# EAGLE schematic single_board_controller_copy (EAGLE 9.3.0)
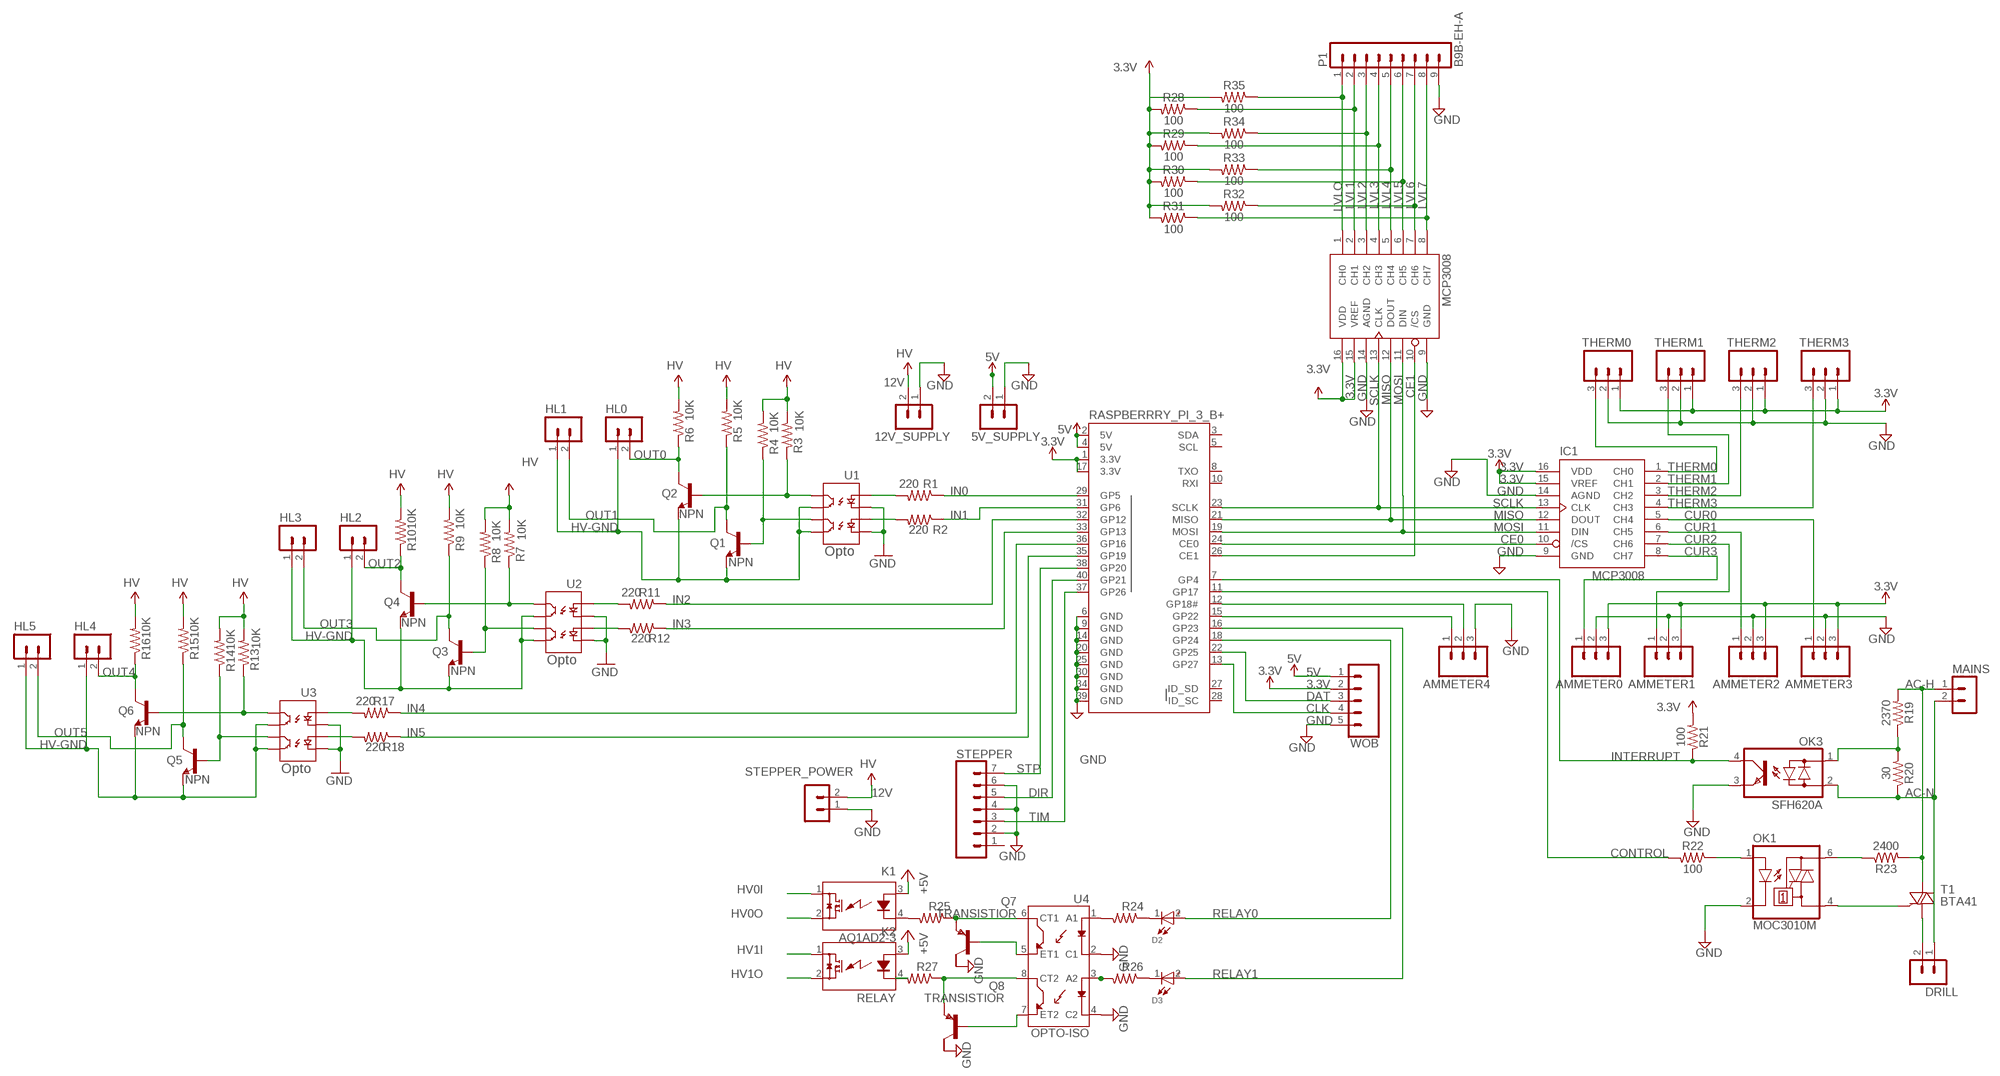
[diagram p0: schematic, sheet 1]

## Parts
5V_SUPPLY  B2P-VH  [B2P-VH]
12V_SUPPLY  B2P-VH  [B2P-VH]
AMMETER0  CONN_03JST-PTH-VERT  [JST-3-PTH-VERT]
AMMETER1  CONN_03JST-PTH-VERT  [JST-3-PTH-VERT]
AMMETER2  CONN_03JST-PTH-VERT  [JST-3-PTH-VERT]
AMMETER3  CONN_03JST-PTH-VERT  [JST-3-PTH-VERT]
AMMETER4  CONN_03JST-PTH-VERT  [JST-3-PTH-VERT]
D2  WL-SMRW_1206_156120YS75000-Y  [WL-SMRW-1206-RECT]
D3  WL-SMRW_1206_156120YS75000-Y  [WL-SMRW-1206-RECT]
DRILL  B2P-VH  [B2P-VH]
HL0  B2P-VH  [B2P-VH]
HL1  B2P-VH  [B2P-VH]
HL2  B2P-VH  [B2P-VH]
HL3  B2P-VH  [B2P-VH]
HL4  B2P-VH  [B2P-VH]
HL5  B2P-VH  [B2P-VH]
IC1  MCP3008  [DIL16]
IC2  MCP3008  [DIL16]
K1  AQ1AD2-3  [AQ1]
K2  RELAY  AQ1AD2-3  [AQ1]
MAINS  B2P-VH  [B2P-VH]
OK1  MOC3010M  [DIL06]
OK3  SFH620A  [DIL04]
P1  B9B-EH-A  [B9B-EH-A]
Q1  NPN  TRANSISTOR_NPNMMBT2222A  [SOT23-3]
Q2  NPN  TRANSISTOR_NPNMMBT2222A  [SOT23-3]
Q3  NPN  TRANSISTOR_NPNMMBT2222A  [SOT23-3]
Q4  NPN  TRANSISTOR_NPNMMBT2222A  [SOT23-3]
Q5  NPN  TRANSISTOR_NPNMMBT2222A  [SOT23-3]
Q6  NPN  TRANSISTOR_NPNMMBT2222A  [SOT23-3]
Q7  TRANSISTIOR  PNP-TRANSISTIOR-2COLSOT89  [SOT89]
Q8  TRANSISTIOR  PNP-TRANSISTIOR-2COLSOT89  [SOT89]
R1  220  220OHM-1/10W-1%(0603)  [0603-RES]
R2  220  220OHM-1/10W-1%(0603)  [0603-RES]
R3  10K  10KOHM1/10W1%(0603)0603  [0603-RES]
R4  10K  10KOHM1/10W1%(0603)0603  [0603-RES]
R5  10K  10KOHM1/10W1%(0603)0603  [0603-RES]
R6  10K  10KOHM1/10W1%(0603)0603  [0603-RES]
R7  10K  10KOHM1/10W1%(0603)0603  [0603-RES]
R8  10K  10KOHM1/10W1%(0603)0603  [0603-RES]
R9  10K  10KOHM1/10W1%(0603)0603  [0603-RES]
R10  10K  10KOHM1/10W1%(0603)0603  [0603-RES]
R11  220  220OHM-1/10W-1%(0603)  [0603-RES]
R12  220  220OHM-1/10W-1%(0603)  [0603-RES]
R13  10K  10KOHM1/10W1%(0603)0603  [0603-RES]
R14  10K  10KOHM1/10W1%(0603)0603  [0603-RES]
R15  10K  10KOHM1/10W1%(0603)0603  [0603-RES]
R16  10K  10KOHM1/10W1%(0603)0603  [0603-RES]
R17  220  220OHM-1/10W-1%(0603)  [0603-RES]
R18  220  220OHM-1/10W-1%(0603)  [0603-RES]
R19  2370  0.3OHM-0805-1/8W-1%  [0805]
R20  30  0.3OHM-0805-1/8W-1%  [0805]
R21  100  0.3OHM-0805-1/8W-1%  [0805]
R22  100  0.3OHM-0805-1/8W-1%  [0805]
R23  2400  0.3OHM-0805-1/8W-1%  [0805]
R24  FLIPFLOP-RES  [0805-THM]
R25  FLIPFLOP-RES  [0805-THM]
R26  FLIPFLOP-RES  [0805-THM]
R27  FLIPFLOP-RES  [0805-THM]
R28  100  0.3OHM-0805-1/8W-1%  [0805]
R29  100  0.3OHM-0805-1/8W-1%  [0805]
R30  100  0.3OHM-0805-1/8W-1%  [0805]
R31  100  0.3OHM-0805-1/8W-1%  [0805]
R32  100  0.3OHM-0805-1/8W-1%  [0805]
R33  100  0.3OHM-0805-1/8W-1%  [0805]
R34  100  0.3OHM-0805-1/8W-1%  [0805]
R35  100  0.3OHM-0805-1/8W-1%  [0805]
RASPBERRRY_PI_3_B+  RASPBERRYPI-40-PIN-GPIO_PTH_NO_SHROUD  [2X20]
STEPPER  CONN_07  [1X07]
STEPPER_POWER  B2P-VH  [B2P-VH]
T1  BTA41  BTA26-H  [TOP3L-1]
THERM0  CONN_03JST-PTH-VERT  [JST-3-PTH-VERT]
THERM1  CONN_03JST-PTH-VERT  [JST-3-PTH-VERT]
THERM2  CONN_03JST-PTH-VERT  [JST-3-PTH-VERT]
THERM3  CONN_03JST-PTH-VERT  [JST-3-PTH-VERT]
U1  OPTOISOLATOR-2SOIC8  [SO08-2]
U2  OPTOISOLATOR-2SOIC8  [SO08-2]
U3  OPTOISOLATOR-2SOIC8  [SO08-2]
U4  OPTO-ISO  ILD213T-IDL213T  [SO08]
WOB  CONN_05JST-VERT  [JST-5-PTH-VERT]

## Nets
3.3V: AMMETER0.3 AMMETER1.3 AMMETER2.3 AMMETER3.3 IC1.15(VREF) IC1.16(VDD) IC2.15(VREF) IC2.16(VDD) R21.2 R28.2 R29.2 R30.2 R31.2 R32.2 R33.2 R34.2 R35.2 RASPBERRRY_PI_3_B+.1(3.3V) RASPBERRRY_PI_3_B+.17(3.3V) THERM0.1 THERM1.1 THERM2.1 THERM3.1 WOB.2
5V: 5V_SUPPLY.2 RASPBERRRY_PI_3_B+.2(5V) RASPBERRRY_PI_3_B+.4(5V) WOB.1
12V: 12V_SUPPLY.2 R3.2 R4.2 R5.2 R6.2 R7.2 R8.2 R9.2 R10.2 R13.2 R14.2 R15.2 R16.2 STEPPER_POWER.2 ; supply symbol labelled HV
+5V: K1.3(A) K2.3(A)
AC-H: MAINS.1 R19.2 R23.2 T1.A2
AC-N: DRILL.1 MAINS.2 OK3.2(AC2) R20.1
CE0: IC1.10(/CS) RASPBERRRY_PI_3_B+.24(CE0)
CE1: IC2.10(/CS) RASPBERRRY_PI_3_B+.26(CE1)
CLK: RASPBERRRY_PI_3_B+.13(GP27) WOB.4
CONTROL: R22.2 RASPBERRRY_PI_3_B+.11(GP17)
CUR0: AMMETER3.1 IC1.5(CH4)
CUR1: AMMETER2.1 IC1.6(CH5)
CUR2: AMMETER1.1 IC1.7(CH6)
CUR3: AMMETER0.1 IC1.8(CH7)
DAT: RASPBERRRY_PI_3_B+.22(GP25) WOB.3
DIR: RASPBERRRY_PI_3_B+.40(GP21) STEPPER.5
GND: 5V_SUPPLY.1 12V_SUPPLY.1 AMMETER0.2 AMMETER1.2 AMMETER2.2 AMMETER3.2 AMMETER4.3 IC1.9(GND) IC1.14(AGND) IC2.9(GND) IC2.14(AGND) OK1.2(C) OK3.3(E) P1.9 Q7.2(C) Q8.2(C) RASPBERRRY_PI_3_B+.6(GND) RASPBERRRY_PI_3_B+.9(GND) RASPBERRRY_PI_3_B+.14(GND) RASPBERRRY_PI_3_B+.20(GND) RASPBERRRY_PI_3_B+.25(GND) RASPBERRRY_PI_3_B+.30(GND) RASPBERRRY_PI_3_B+.34(GND) RASPBERRRY_PI_3_B+.39(GND) STEPPER.2 STEPPER.4 STEPPER.6 STEPPER_POWER.1 THERM0.2 THERM1.2 THERM2.2 THERM3.2 U1.2(C1) U1.4(C2) U2.2(C1) U2.4(C2) U3.2(C1) U3.4(C2) U4.2(C1) U4.4(C2) WOB.5
HV0I: K1.1(DS1)
HV0O: K1.2(DS2)
HV1I: K2.1(DS1)
HV1O: K2.2(DS2)
HV-GND: HL0.1 HL1.1 HL2.1 HL3.1 HL4.1 HL5.1 Q1.2(E) Q2.2(E) Q3.2(E) Q4.2(E) Q5.2(E) Q6.2(E) U1.5(EM2) U1.7(EM1) U2.5(EM2) U2.7(EM1) U3.5(EM2) U3.7(EM1)
IN0: R1.1 RASPBERRRY_PI_3_B+.29(GP5)
IN1: R2.1 RASPBERRRY_PI_3_B+.31(GP6)
IN2: R11.1 RASPBERRRY_PI_3_B+.32(GP12)
IN3: R12.1 RASPBERRRY_PI_3_B+.33(GP13)
IN4: R17.1 RASPBERRRY_PI_3_B+.36(GP16)
IN5: R18.1 RASPBERRRY_PI_3_B+.35(GP19)
INTERRUPT: OK3.4(C) R21.1 RASPBERRRY_PI_3_B+.7(GP4)
LVL1: IC2.2(CH1) P1.2 R28.1
LVL2: IC2.3(CH2) P1.3 R34.1
LVL3: IC2.4(CH3) P1.4 R29.1
LVL4: IC2.5(CH4) P1.5 R33.1
LVL5: IC2.6(CH5) P1.6 R30.1
LVL6: IC2.7(CH6) P1.7 R32.1
LVL7: IC2.8(CH7) P1.8 R31.1
LVLO: IC2.1(CH0) P1.1 R35.1
MISO: IC1.12(DOUT) IC2.12(DOUT) RASPBERRRY_PI_3_B+.21(MISO)
MOSI: IC1.11(DIN) IC2.11(DIN) RASPBERRRY_PI_3_B+.19(MOSI)
N$1: R1.2 U1.1(A1)
N$2: R2.2 U1.3(A2)
N$3: R11.2 U2.1(A1)
N$4: R12.2 U2.3(A2)
N$5: R17.2 U3.1(A1)
N$6: R18.2 U3.3(A2)
N$7: OK3.1(AC1) R19.1 R20.2
N$8: OK1.1(A) R22.1
N$9: OK1.6(A2) R23.1
N$10: OK1.4(A1) T1.G
N$11: DRILL.2 T1.A1
N$12: R24.2 U4.1(A1)
N$13: D2.1(-) R24.1
N$14: R26.2 U4.3(A2)
N$15: D3.1(-) R26.1
N$16: Q7.3(E) R25.1 U4.6(CT1)
N$17: K1.4(K) R25.2
N$18: Q8.3(E) R27.1 U4.8(CT2)
N$19: K2.4(K) R27.2
N$20: Q7.1(B) U4.5(ET1)
N$21: Q8.1(B) U4.7(ET2)
N$22: AMMETER4.1 RASPBERRRY_PI_3_B+.15(GP22)
N$23: AMMETER4.2 RASPBERRRY_PI_3_B+.12(GP18#)
OUT0: HL0.2 Q2.3(C) R6.1
OUT1: HL1.2 Q1.3(C) R5.1
OUT1N: Q2.1(B) R3.1 U1.8(CL1)
OUT1N1: Q4.1(B) R7.1 U2.8(CL1)
OUT1N2: Q6.1(B) R13.1 U3.8(CL1)
OUT2: HL2.2 Q4.3(C) R10.1
OUT2N: Q1.1(B) R4.1 U1.6(CL2)
OUT2N1: Q3.1(B) R8.1 U2.6(CL2)
OUT2N2: Q5.1(B) R14.1 U3.6(CL2)
OUT3: HL3.2 Q3.3(C) R9.1
OUT4: HL4.2 Q6.3(C) R16.1
OUT5: HL5.2 Q5.3(C) R15.1
RELAY0: D2.2(+) RASPBERRRY_PI_3_B+.18(GP24)
RELAY1: D3.2(+) RASPBERRRY_PI_3_B+.16(GP23)
SCLK: IC1.13(CLK) IC2.13(CLK) RASPBERRRY_PI_3_B+.23(SCLK)
STP: RASPBERRRY_PI_3_B+.38(GP20) STEPPER.7
THERM0: IC1.1(CH0) THERM0.3
THERM1: IC1.2(CH1) THERM1.3
THERM2: IC1.3(CH2) THERM2.3
THERM3: IC1.4(CH3) THERM3.3
TIM: RASPBERRRY_PI_3_B+.37(GP26) STEPPER.3
Unconnected: Q7.2@1(C/) Q8.2@1(C/) RASPBERRRY_PI_3_B+.3(SDA) RASPBERRRY_PI_3_B+.5(SCL) RASPBERRRY_PI_3_B+.8(TXO) RASPBERRRY_PI_3_B+.10(RXI) RASPBERRRY_PI_3_B+.27(ID_SD) RASPBERRRY_PI_3_B+.28(ID_SC) STEPPER.1

## Notes on the sheet
- Opto
- Opto
- Opto

## Library data of the parts
5V_SUPPLY 12V_SUPPLY DRILL HL0 HL1-HL5 MAINS STEPPER_POWER = con-jst-vh:B2P-VH: HEADER
AMMETER0 AMMETER1-AMMETER4 THERM0 THERM1-THERM3 = SparkFun-Connectors:CONN_03: Multi connection point. Often used as Generic Header-pin footprint for 0.1 inch spaced/style header connections On any of the 0.1 inch spaced packages, you can populate with these: Break Away Headers - Straight <https://www.sparkfun.com/products/116> (PRT-00116) Break Away Male Headers - Right Angle <https://www.sparkfun.com/products/553> (PRT-00553) Female Headers <https://www.sparkfun.com/products/115> (PRT-00115) Break Away Headers - Machine Pin <https://www.sparkfun.com/products/117> (PRT-00117) Break Away Female Headers - Swiss Machine Pin <https://www.sparkfun.com/products/743> (PRT-00743) Stackable Header - 3 Pin (Female, 0.1") <https://www.sparkfun.com/products/13875> (PRT-13875) For SCREWTERMINALS and SPRING TERMINALS visit here: Screw Terimnals on SparkFun.com <https://www.sparkfun.com/search/results?term=Screw+Terminals> (5mm/3.5mm/2.54mm spacing) This device is also useful as a general connection point to wire up your design to another part of your project. Our various solder wires solder well into these plated through hole pads. Hook-Up Wire - Assortment (Stranded, 22 AWG) <https://www.sparkfun.com/products/11375> (PRT-11375) Hook-Up Wire - Assortment (Solid Core, 22 AWG) <https://www.sparkfun.com/products/11367> (PRT-11367) View the entire wire category on our website here <https://www.sparkfun.com/categories/141> Special notes: Molex polarized connector foot print use with SKU : PRT-08232 with associated crimp pins and housings.; PROD_ID: CONN-13230
D2 D3 = Wurth_Elektronik_Optoelectronics_rev18a:WL-SMRW_1206: WL-SMRW SMD Mono-color Reverse mount Waterclear Characteristics Ideal for narrow space applications Narrow viewing angle Low power consumption Industry standard footprint Small package for exceptional brightness To emit light through a small cut-out hole in PCB Compatible with automatic placement machine Applications Front panels indicators LCD backlighting Backlighting for keypad, symbol and switch button Messaenger board Networking and telecommunications Mobile devices Instrumentation Fitness wearables Audio and video Medical and healthcare <http://katalog.we-online.de/media/images/v2/Family_WL-SMRW_neu.jpg> Details see: http://katalog.we-online.de/en/led/WL-SMRW?m <http://katalog.we-online.de/media/images/v2/Family_WL-SMRW_neu.jpg> Details see: http://katalog.we-online.de/en/led/WL-SMRW?m Updated 2015-04-10 2015 (C) Wurth Elektronik
IC1 IC2 = adafruit:MCP3008
K1 K2 = relay:AQ*: SOLID STATE RELAY NAiS Source: http://www.mew-europe.com/.. en_ds_61601_0000.pdf; MF: AROMAT/ MATSUSHITA; MPN: AQ1AD2-3/28VDC; OC_FARNELL: unknown; OC_NEWARK: 10C4052
OK1 = optocoupler:MOC30*M: RANDOM-PHASE OPTOISOLATORS TRIAC DRIVER OUTPUT Source: http://www.fairchildsemi.com MOC3020-M.pdf; MF: FAIRCHILD SEMICONDUCTOR; MPN: MOC3010-M; OC_FARNELL: 1505423; OC_NEWARK: 72K8892
OK3 = optocoupler:SFH620: Optocoupler, Phototransistor Output, AC Input Source: http://www.vishay.com/docs/83675/sfh620.pdf; MPN: SFH620A-2; OC_FARNELL: 1469594; OC_NEWARK: 97K9546
P1 = con-jst-eh:B9B-EH-A: HEADER
Q1-Q6 = SparkFun-DiscreteSemi:TRANSISTOR_NPN: Generic NPN BJT MMBT2222A - TRANS-08049 (SOT-23, 1A 40V) MPSA42 - TRANS-09116 (SOT-23, 500mA 300V) MMBT5088LT1G - TRANS-11160 (SOT-23, 50 mA 30V) BC547 - COM-08928 <http://www.sparkfun.com/products/8928> (TO-92 45V 100mA) (1.Collector 2.Base 3.Emitter) 2N3904 - COM-00521 <http://www.sparkfun.com/products/521> (TO-92 40V 200mA) (1.Emitter 2.Base 3.Collector) P2N2222A - COM-12852 <http://www.sparkfun.com/products/12852> (TO-92 40V 600mA) (1.Collector 2.Base 3.Emitter); PROD_ID: TRANS-08049; VALUE: MMBT2222A
Q7 Q8 = semicon-smd-ipc:PNP-TRANSISTIOR-2COL: PNP TRANSISTOR 2 colletor pins
R1 R2 R11 R12 R17 R18 = SparkFun-Resistors:220OHM-1/10W-1%(0603): RES-07861; PROD_ID: RES-07861
R3-R10 R13-R16 = SparkFun-Resistors:10KOHM1/10W1%(0603): RES-00824; PROD_ID: RES-00824
R19-R23 R28-R35 = SparkFun-Resistors:0.3OHM: 0.3Ω resistor A resistor is a passive two-terminal electrical component that implements electrical resistance as a circuit element. Resistors act to reduce current flow, and, at the same time, act to lower voltage levels within circuits. - Wikipedia; PROD_ID: RES-11622; VALUE: 0.3
R24-R27 = adafruit:FLIPFLOP-RES: Flip Flop resistor An 0805 resistor inside a standard 1/4W 5% resistor. Makes for easy mods
RASPBERRRY_PI_3_B+ = SparkFun-Connectors:RASPBERRYPI-40-PIN-GPIO: Raspberry Pi GPIO Header 2x20 pin connector, as found on B, B+, A+ models. Both shrouded PTH and SMT versions available. SparkFun Products: GPIO Shrouded Header <https://www.sparkfun.com/products/13054>- PTH SparkFun Pi Wedge (Preassembled) <https://www.sparkfun.com/products/13717>
STEPPER = SparkFun-Connectors:CONN_07: Multi connection point. Often used as Generic Header-pin footprint for 0.1 inch spaced/style header connections On any of the 0.1 inch spaced packages, you can populate with these: Break Away Headers - Straight <https://www.sparkfun.com/products/116> (PRT-00116) Break Away Male Headers - Right Angle <https://www.sparkfun.com/products/553> (PRT-00553) Female Headers <https://www.sparkfun.com/products/115> (PRT-00115) Break Away Headers - Machine Pin <https://www.sparkfun.com/products/117> (PRT-00117) Break Away Female Headers - Swiss Machine Pin <https://www.sparkfun.com/products/743> (PRT-00743) For SCREWTERMINALS and SPRING TERMINALS visit here: Screw Terimnals on SparkFun.com <https://www.sparkfun.com/search/results?term=Screw+Terminals> (5mm/3.5mm/2.54mm spacing) This device is also useful as a general connection point to wire up your design to another part of your project. Our various solder wires solder well into these plated through hole pads. Hook-Up Wire - Assortment (Stranded, 22 AWG) <https://www.sparkfun.com/products/11375> (PRT-11375) Hook-Up Wire - Assortment (Solid Core, 22 AWG) <https://www.sparkfun.com/products/11367> (PRT-11367) View the entire wire category on our website here <https://www.sparkfun.com/categories/141> Special notes: Molex polarized connector foot print use with SKU : PRT-08231 with associated crimp pins and housings. 1MM SMD Version SKU: PRT-10208 NOTES ON THE VARIANTS LOCK and LOCK_LONGPADS... This footprint was designed to help hold the alignment of a through-hole component (i.e. 6-pin header) while soldering it into place. You may notice that each hole has been shifted either up or down by 0.005 of an inch from it's more standard position (which is a perfectly straight line). This slight alteration caused the pins (the squares in the middle) to touch the edges of the holes. Because they are alternating, it causes a "brace" to hold the component in place. 0.005 has proven to be the perfect amount of "off-center" position when using our standard breakaway headers. Although looks a little odd when you look at the bare footprint, once you have a header in there, the alteration is very hard to notice. Also,if you push a header all the way into place, it is covered up entirely on the bottom side.
T1 = triac:BTA26: 25A TRIAC Source: http://www.st.com/stonline/products/literature/ds/7470.pdf
U1-U3 = SparkFun-DiscreteSemi:OPTOISOLATOR-2: Description: Dual gate opto isolator. Vishay part : ILD213T; PROD_ID: IC-09076
U4 = SparkFun-DiscreteSemi:ILD213T: Dual Channel Phototransistor Optocoupler Dual Channel 70 V 4000 Vrms Phototransistor Optocoupler in a standard SOIC-8 package. Used to couple signals between electrically isolated circuits. Datasheet <https://www.sparkfun.com/datasheets/Components/SMD/ild205t.pdf> SparkFun Products: SparkFun Opto-Isolator Breakout <https://www.sparkfun.com/products/9118>; PROD_ID: IC-09076
WOB = SparkFun-Connectors:CONN_05: Multi connection point. Often used as Generic Header-pin footprint for 0.1 inch spaced/style header connections On any of the 0.1 inch spaced packages, you can populate with these: Break Away Headers - Straight <https://www.sparkfun.com/products/116> (PRT-00116) Break Away Male Headers - Right Angle <https://www.sparkfun.com/products/553> (PRT-00553) Female Headers <https://www.sparkfun.com/products/115> (PRT-00115) Break Away Headers - Machine Pin <https://www.sparkfun.com/products/117> (PRT-00117) Break Away Female Headers - Swiss Machine Pin <https://www.sparkfun.com/products/743> (PRT-00743) For SCREWTERMINALS and SPRING TERMINALS visit here: Screw Terimnals on SparkFun.com <https://www.sparkfun.com/search/results?term=Screw+Terminals> (5mm/3.5mm/2.54mm spacing) This device is also useful as a general connection point to wire up your design to another part of your project. Our various solder wires solder well into these plated through hole pads. Hook-Up Wire - Assortment (Stranded, 22 AWG) <https://www.sparkfun.com/products/11375> (PRT-11375) Hook-Up Wire - Assortment (Solid Core, 22 AWG) <https://www.sparkfun.com/products/11367> (PRT-11367) View the entire wire category on our website here <https://www.sparkfun.com/categories/141> Special notes: Molex polarized connector foot print use with SKU : PRT-08231 with associated crimp pins and housings. 1MM SMD Version SKU: PRT-10208